# Altium project IIR_Loader.PrjPcb
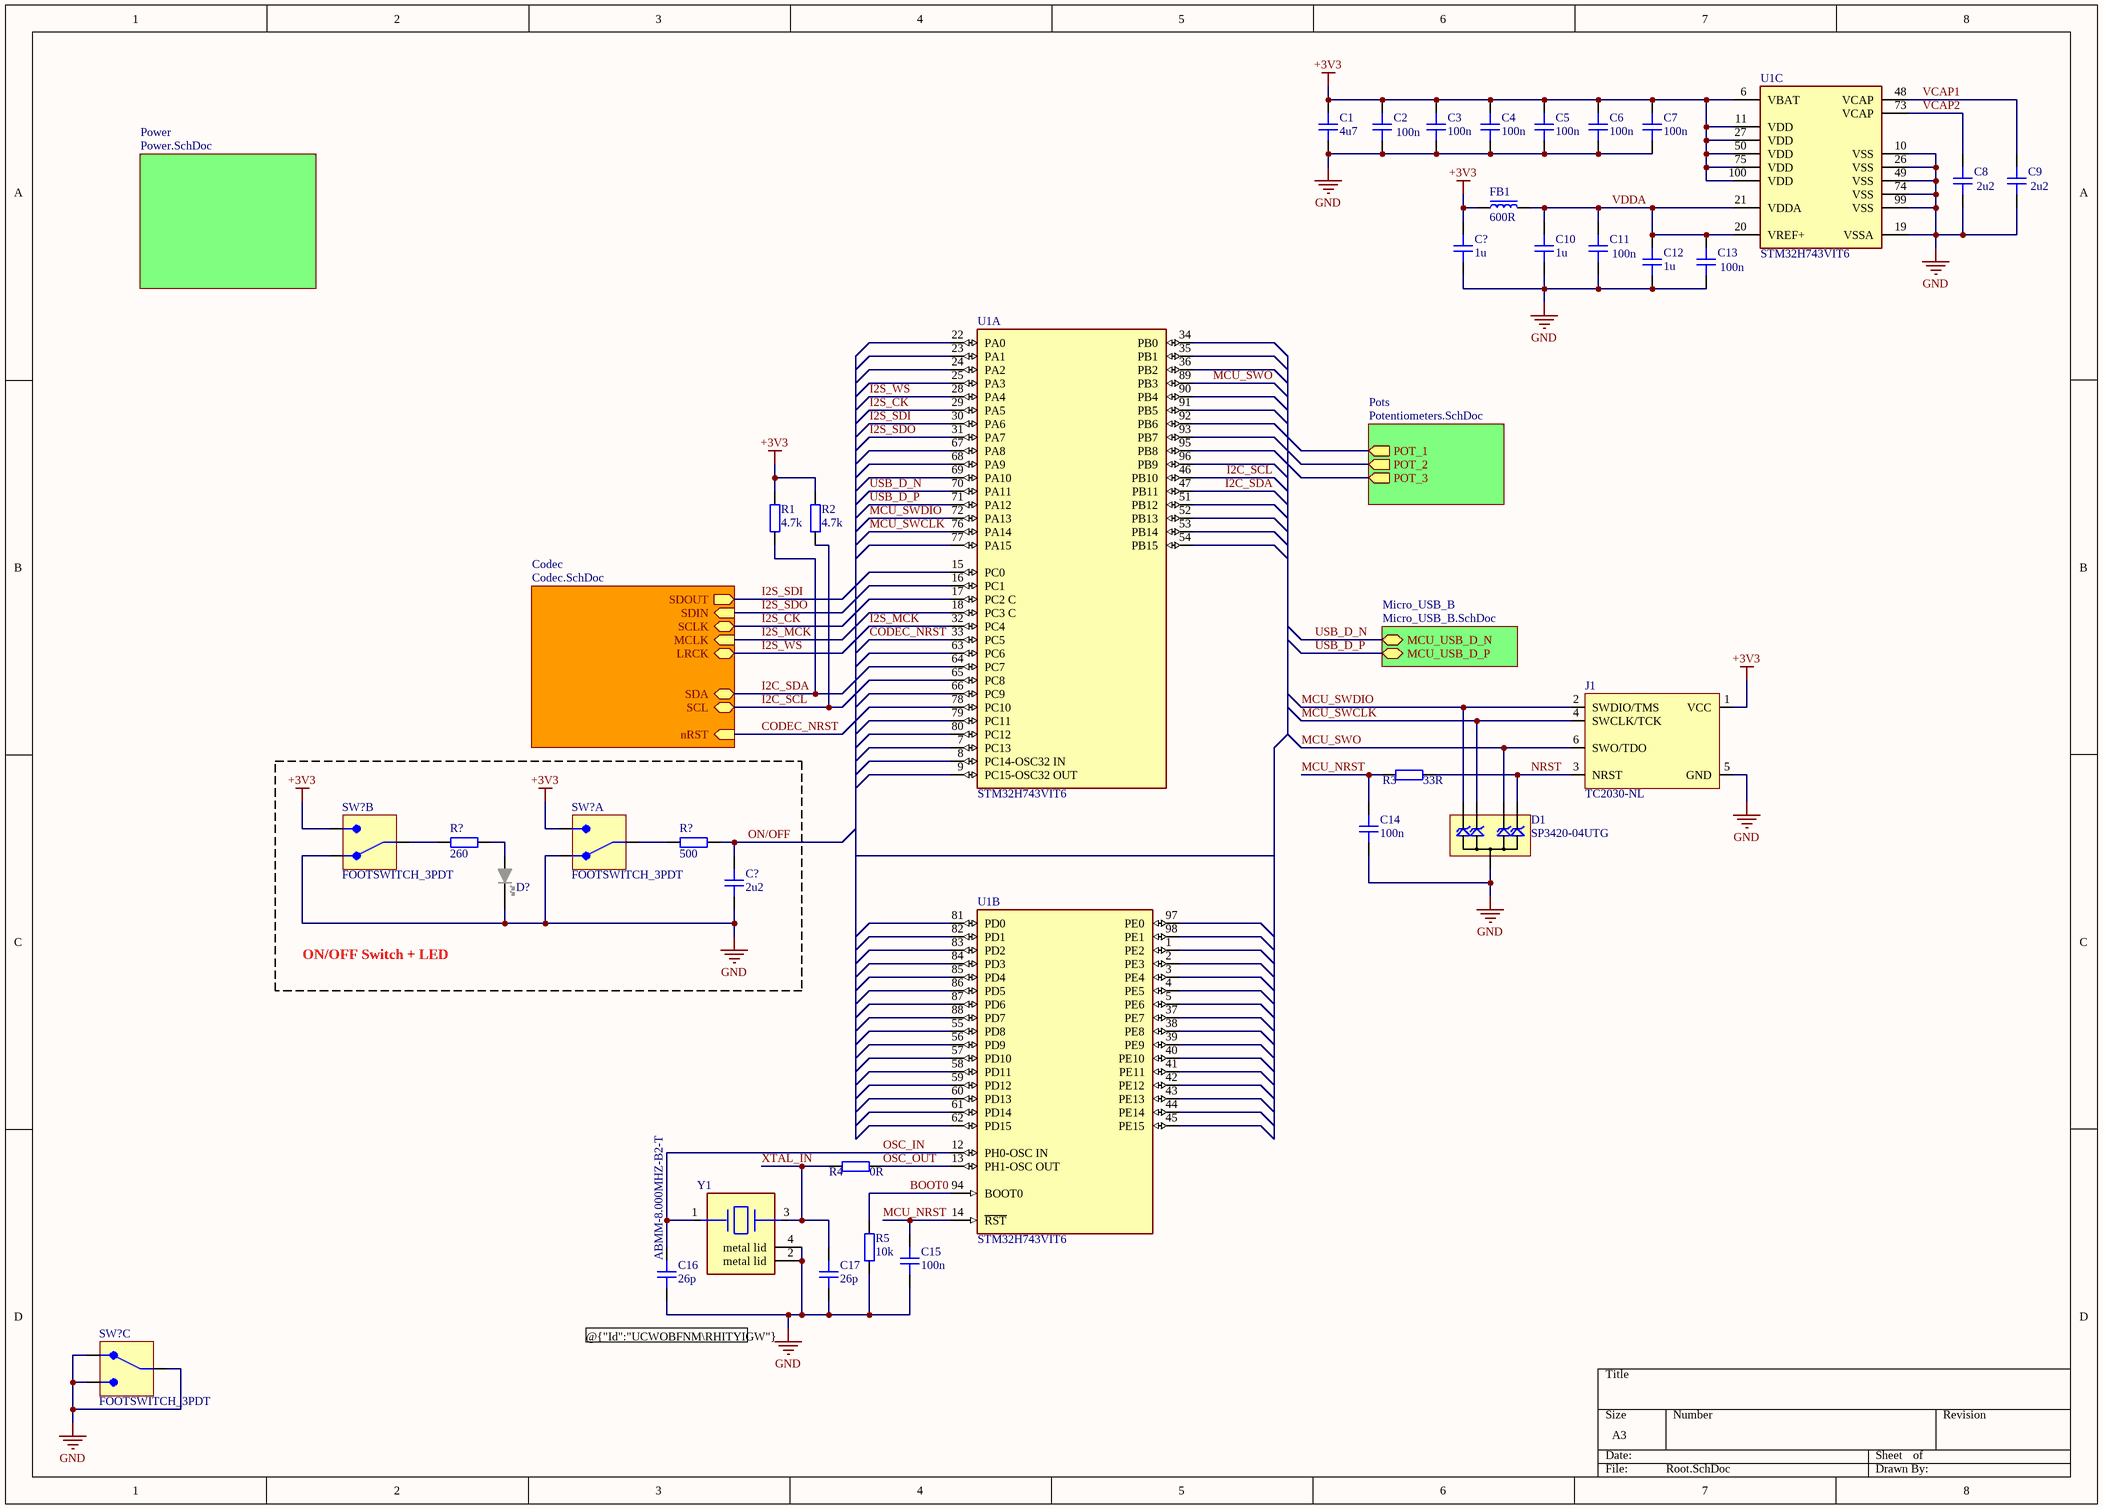
[diagram p0: Root.SchDoc]
6 sheets, 159 parts. Net scope: hierarchical (ports join the sheet entries above them; power ports are global).
Sheets:
  Root.SchDoc
    Micro_USB_B = Micro_USB_B.SchDoc
    Codec = Codec.SchDoc
      FILT3 = RC_Filter.SchDoc
      FILT4 = RC_Filter.SchDoc
      FILT1 = RC_Filter.SchDoc
      FILT2 = RC_Filter.SchDoc
    Power = Power.SchDoc
    Pots = Potentiometers.SchDoc

## Sheet Root.SchDoc
size A3; SheetNumber: 1; SheetTotal: 6

### Parts
(Parts that share a designator on the sheet are numbered #1, #2 ... from top to bottom, then left to right.)
C1  4u7  [CAP_0603]
C2  100n  [CAP_0402]
C3  100n  [CAP_0402]
C4  100n  [CAP_0402]
C5  100n  [CAP_0402]
C6  100n  [CAP_0402]
C7  100n  [CAP_0402]
C8  2u2  [CAP_0402]
C9  2u2  [CAP_0402]
C10  1u  [CAP_0603]
C11  100n  [CAP_0402]
C12  1u  [CAP_0603]
C13  100n  [CAP_0402]
C14  100n  [CAP_0402]
C15  100n  [CAP_0402]
C16  26p  [CAP_0402]
C17  26p  [CAP_0402]
C?#1  1u  [CAP_0603]
C?#2  2u2  [CAP_0603]
D1  SP3420-04UTG  [uDFN-10]
D?#1  LED  [SLM-490]  (value not drawn)
FB1  600R  [FB_0805]
J1  TC2030-NL  [TC2030-NL-FP]  (no BOM)
R1  4.7k  [RES_0402]
R2  4.7k  [RES_0402]
R3  33R  [RES_0402]
R4  0R  [RES_0402]
R5  10k  [RES_0402]
R?#1  260  [RES_0603]
R?#2  500  [RES_0603]
SW?#1  FOOTSWITCH_3PDT  [FOOTSWITCH_3PDT]  (part B of 3)
SW?#2  FOOTSWITCH_3PDT  [FOOTSWITCH_3PDT]  (part A of 3)
SW?#3  FOOTSWITCH_3PDT  [FOOTSWITCH_3PDT]  (part C of 3)
U1  STM32H743VIT6  [FP-LQFP100-1L-MFG]  (parts A,B,C of 3)
Y1  ABMM-8.000MHZ-B2-T  [FP-ABMM-MFG]

### Blocks framed on the sheet
ON/OFF Switch + LED: C?#2 D?#1 R?#1 R?#2 SW?#1 SW?#2

### Sub-sheets
Codec = Codec.SchDoc: SDIN (in), SDOUT (out), LRCK (bidir), SCLK (bidir), MCLK (in), SDA (bidir), SCL (bidir), nRST (in)
Micro_USB_B = Micro_USB_B.SchDoc: MCU_USB_D_N (bidir), MCU_USB_D_P (bidir)
Pots = Potentiometers.SchDoc: POT_1 (out), POT_2 (out), POT_3 (out)
Power = Power.SchDoc: no entries

### Nets
+3V3: C1.2 C2.2 C3.2 C4.2 C5.2 C6.2 C7.2 C?#1.2 FB1.1 J1.1(VCC) R1.2 R2.2 SW?#1.NO2 SW?#2.NO1 U1.6(VBAT) U1.11(VDD) U1.27(VDD) U1.50(VDD) U1.75(VDD) U1.100(VDD)
GND: C1.1 C2.1 C3.1 C4.1 C5.1 C6.1 C7.1 C8.1 C9.1 C10.1 C11.1 C12.1 C13.1 C14.1 C15.1 C16.1 C17.1 C?#1.1 C?#2.1 D1.38(GND) D?#1.K J1.5(GND) R5.1 SW?#1.NC2 SW?#2.NC1 SW?#3.COM3 SW?#3.NC3 SW?#3.NO3 U1.10(VSS) U1.19(VSSA) U1.26(VSS) U1.49(VSS) U1.74(VSS) U1.99(VSS) Y1.2(metal_lid) Y1.4(metal_lid)
BOOT0: R5.2 U1.94(BOOT0)
CODEC_NRST: U1.33(PC5) ; sheet Codec/nRST
I2C_SCL: R2.1 U1.46(PB10) ; sheet Codec/SCL
I2C_SDA: R1.1 U1.47(PB11) ; sheet Codec/SDA
I2S_CK: U1.29(PA5) ; sheet Codec/SCLK
I2S_MCK: U1.32(PC4) ; sheet Codec/MCLK
I2S_SDI: U1.30(PA6) ; sheet Codec/SDOUT
I2S_SDO: U1.31(PA7) ; sheet Codec/SDIN
I2S_WS: U1.28(PA4) ; sheet Codec/LRCK
MCU_NRST: C14.2 C15.2 R3.1 U1.14(~{RST})
MCU_SWCLK: D1.29 J1.4(SWCLK/TCK) U1.76(PA14)
MCU_SWDIO: D1.110 J1.2(SWDIO/TMS) U1.72(PA13)
MCU_SWO: D1.47 J1.6(SWO/TDO) U1.89(PB3)
NRST: D1.56 J1.3(NRST) R3.2
ON/OFF: C?#2.2 R?#2.1
OSC_IN: C16.2 U1.12(PH0-OSC_IN) Y1.1
OSC_OUT: R4.2 U1.13(PH1-OSC_OUT)
USB_D_N: U1.70(PA11) ; sheet Micro_USB_B/MCU_USB_D_N  [project net MCU_USB_D_N]
USB_D_P: U1.71(PA12) ; sheet Micro_USB_B/MCU_USB_D_P  [project net MCU_USB_D_P]
VCAP1: C9.2 U1.48(VCAP)
VCAP2: C8.2 U1.73(VCAP)
VDDA: C10.2 C11.2 C12.2 C13.2 FB1.2 U1.20(VREF+) U1.21(VDDA)
XTAL_IN: C17.2 R4.1 Y1.3
NetD?#1_A: D?#1.A R?#1.1
NetR?#1_2: R?#1.2 SW?#1.COM2
NetR?#2_2: R?#2.2 SW?#2.COM1

Not connected (* = marked no-connect by the designer): U1 1(PE2) 2(PE3) 3(PE4) 4(PE5) 5(PE6) 7(PC13) 8(PC14-OSC32_IN) 9(PC15-OSC32_OUT) 15(PC0) 16(PC1) 17(PC2_C) 18(PC3_C) 22(PA0) 23(PA1) 24(PA2) 25(PA3) 34(PB0) 35(PB1) 36(PB2) 37(PE7) 38(PE8) 39(PE9) 40(PE10) 41(PE11) 42(PE12) 43(PE13) 44(PE14) 45(PE15) 51(PB12) 52(PB13) 53(PB14) 54(PB15) 55(PD8) 56(PD9) 57(PD10) 58(PD11) 59(PD12) 60(PD13) 61(PD14) 62(PD15) 63(PC6) 64(PC7) 65(PC8) 66(PC9) 67(PA8) 68(PA9) 69(PA10) 77(PA15) 78(PC10) 79(PC11) 80(PC12) 81(PD0) 82(PD1) 83(PD2) 84(PD3) 85(PD4) 86(PD5) 87(PD6) 88(PD7) 90(PB4) 91(PB5) 92(PB6) 93(PB7) 95(PB8) 96(PB9) 97(PE0) 98(PE1)

### Notes on the sheet
- (near C16) @{"Id":"UCWOBFNM\RHITYIGW"} & @{"Id":"UCWOBFNM\OAWXIDPK"} Class I Capacitors

### Library data of the parts
C1 C10 C12 C?#1 = CAP_0603: 16V; Manufacturer: *; Manufacturer Part Number: *; Distributor Link: *; LCSC: *; Rating: *; Dielectric: *
C2-C9 C11 C13-C15 = CAP_0402: 16V; Manufacturer: *; Manufacturer Part Number: *; Distributor Link: *; LCSC: *; Rating: *; Dielectric: *
C16 C17 = CAP_0402: Capacitor SMD 0402; Manufacturer: *; Manufacturer Part Number: *; Distributor Link: *; LCSC: *; Rating: *; Dielectric: *
C?#2 = CAP_0603: Capacitor SMD 0603; Manufacturer: *; Manufacturer Part Number: *; Distributor Link: *; LCSC: *; Rating: *; Dielectric: *
D1 = SP3420-04UTG: TVS Diode Array Low Capacitance ESD Protection 4-Channel (Vwork=3V3, Vclamp=6V); Manufacturer: Littelfuse; Manufacturer Part Number: SP3420-04UTG
D?#1 = LED_5MM_HOLDER_16MM1: 5mm LED Holder Height 16.1mm (w/o LED); Manufacturer: BIVAR; Manufacturer Part Number: SLM-490
FB1 = FB_0805: 300mOhm DC, 600R @ 100MHz; Manufacturer: *; Manufacturer Part Number: *; Distributor Link: *; LCSC: *
J1 = TC2030-NL: Tag-Connect No-Solder SWD Debug Connector (No Legs) DO NOT PLACE; Manufacturer: Tag-Connect; Manufacturer Part Number: TC2030-NL-FP
R1-R5 = RES_0402: Resistor SMD 0402; Manufacturer: *; Manufacturer Part Number: *; Distributor Link: *; LCSC: *
R?#1 R?#2 = RES_0603: Resistor SMD 0603; Manufacturer: *; Manufacturer Part Number: *; Distributor Link: *; LCSC: *
SW?#1-SW?#3 = FOOTSWITCH_3PDT: Generic 3PDT Footswitch; Manufacturer: *; Manufacturer Part Number: *; Link: https://lovemyswitches.com/3pdt-latched-foot-switch-solder-lugs-black/
U1 = CMP-12105-000050-1: IC MCU 32BIT 2MB FLASH 100LQFP; Manufacturer: STMicroelectronics; Number Of Ethernet Channels: 1; Number Of Usb Channels: 2; Number Of A/D Converters: 3; Min Supply Voltage: 1.71V; Ram Size: 1060KBytes; Number Of I2C Channels: 4; Frequency: 480MHz; Number Of Adc Channels: 36; Number Of I/Os: 82; Max Supply Voltage: 3.6V; Number Of Spi Channels: 6; Memory Size: 2MBytes; Max Junction Temp: +125°C; Core Architecture: Arm Cortex-M7; Interface: I2C,SPI,UART,USART,USB,LIN,IrDA,Ethernet,I2S,Other; Number Of Timers/Counters: 20; Data Bus Width: 32bits; Number Of Pwm Channels: 42; Number Of Uart Channels: 9; Standoff Height: 0.05mm; Device Class L1: Integrated Circuits (ICs); ComponentLink2URL: https://www.st.com/resource/en/datasheet/stm32h743vi.pdf; Automotive: No; Memory Type: FLASH; Number Of Cores: 1; Temperature Range Low: -40°C; RoHS: TRUE; Ambient Temperature Range Low: -40°C; ComponentLink2Description: Datasheet; Device Class L2: Embedded Processors and Controllers; Device Class L3: Microcontrollers; Digikey Description: IC MCU 32BIT 2MB FLASH 100LQFP; Temperature Range High: +125°C; Ambient Temperature Range High: +85°C; Package: LQFP100-1L; Temperature: -40°C to +125°C; Category: IC; Ipc Land Pattern Name: QFP50P1600X1600X160-100; Height: 1.6mm; Manufacturer Part Number: STM32H743VIT6; Octopart: https://octopart.com/stm32h743vit6-stmicroelectronics-76372527; Lead Free: Yes
Y1 = CMP-27762-006043-1: CRYSTAL 8.0000MHZ 18PF SMD; Tolerance: 20ppm; Frequency: 8MHz; Frequency Stability: 50ppm; Operating Frequency: 8 MHz; ESR (Equivalent Series Resistance): 70R; Package Quantity: 1000; Number of Pins: 4; Mount: Surface Mount; Accuracy: 20ppm; Depth: 5.2mm; Resistor Type: Ceramic; Lead Free: Lead Free; Series: ABMM; Packaging: Tape and Reel; Length: 7.2mm; REACH SVHC: No SVHC; Termination: SMD/SMT; Load Capacitance: 18pF; Case/Package: CSMD; Width: 0.197inch; Max Operating Temperature: 70°C; Radiation Hardening: No; Series Resistance: 70R; Frequency Tolerance: 20ppm; Min Operating Temperature: -20°C; Height: 0.051inch

## Sheet Micro_USB_B.SchDoc
size A4; SheetNumber: 2; SheetTotal: 6
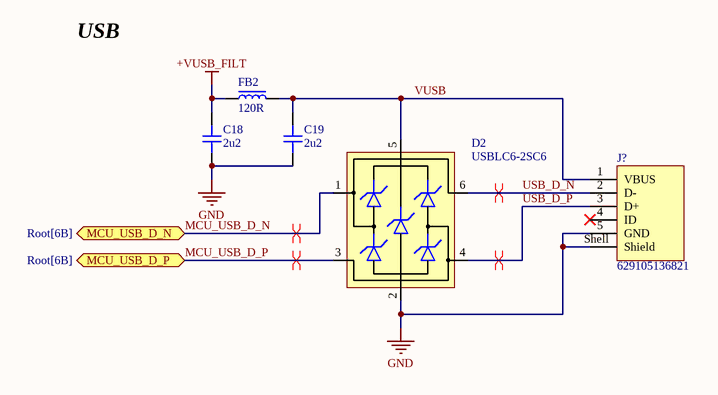
[diagram p1: Micro_USB_B.SchDoc]

### Parts
C18  2u2  [CAP_0603]
C19  2u2  [CAP_0603]
D2  USBLC6-2SC6  [SOT-23-6]
FB2  120R  [FB_0603]
J?  629105136821  [629105136821]

### Ports
MCU_USB_D_N (bidir, see Root[6B]), MCU_USB_D_P (bidir, see Root[6B])

### Nets
+VUSB_FILT: C18.2 FB2.1
GND: C18.1 C19.1 D2.2(GND) J?.5(GND) J?.Shell(Shield)
MCU_USB_D_N: D2.1(IO1) ; port MCU_USB_D_N
MCU_USB_D_P: D2.3(IO2) ; port MCU_USB_D_P
USB_D_N: D2.6(IO1) J?.2(D-)
USB_D_P: D2.4(IO2) J?.3(D+)
VUSB: C19.2 D2.5(VBUS) FB2.2 J?.1(VBUS)

Not connected (* = marked no-connect by the designer): J? 4(ID)*

### Layout directives
differential pair: MCU_USB_D_N, MCU_USB_D_P, USB_D_N, USB_D_P

### Notes on the sheet
- USB

### Library data of the parts
C18 C19 = CAP_0603: 16V; Manufacturer: *; Manufacturer Part Number: *; Distributor Link: *; LCSC: *; Rating: *; Dielectric: *
D2 = USBLC6-2SC6: Low-Capacitance ESD Protection USB; Manufacturer: STMicroelectronics; Manufacturer Part Number: USBLC6-2SC6; Distributor Link: https://www.mouser.de/ProductDetail/STMicroelectronics/USBLC6-2SC6?qs=po45yt2pPpu%2FhNIlwQdTlg%3D%3D
FB2 = FB_0603: 30mOhm; Manufacturer: *; Manufacturer Part Number: *; Distributor Link: *; LCSC: *
J? = CMP-1502-03253-2: NexarPartId: 19991173; Insulation Resistance: 1GΩ; Contact Resistance: 30mΩ; Number of Contacts: 5; Number of Ports: 1; Gender: Receptacle; Current Rating: 1A; Connector Type: USB; Voltage Rating: 30V; USB Standard: USB 2.0; Plating: Nickel; Max Operating Temperature: 105°C; Orientation: Horizontal; Height: 2.9mm; Termination: Solder; Min Operating Temperature: -40°C; Number of Pins: 5; Flammability Rating: UL94 V-0; Lead Free: Lead Free; Packaging: Tape and Reel; Contact Plating: Gold; RoHS: Compliant; Mount: Horizontal, Surface Mount; Color: Black; REACH SVHC: Unknown; Operating Supply Voltage: 30V; Contact Material: Copper; Number of Positions: 5; Length: 5.9mm

## Sheet Codec.SchDoc
size A4; SheetNumber: 3; SheetTotal: 6
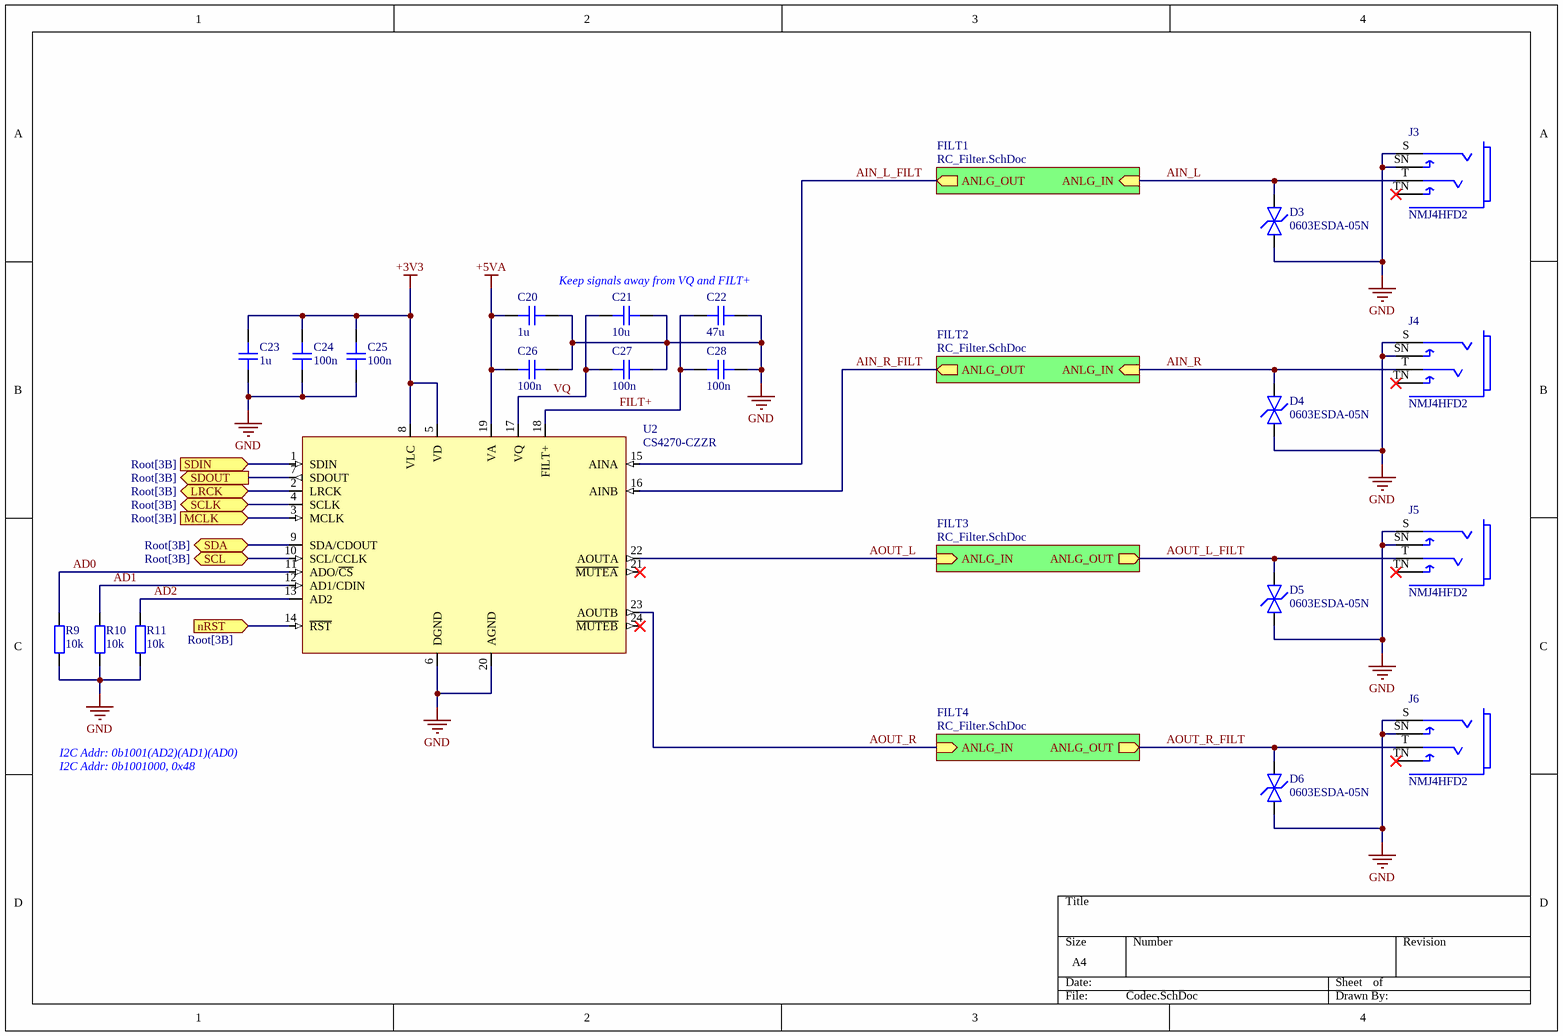
[diagram p2: Codec.SchDoc]

### Parts
C20  1u  [CAP_0603]
C21  10u  [CAP_1210]
C22  47u  [CAP_1210]
C23  1u  [CAP_0603]
C24  100n  [CAP_0603]
C25  100n  [CAP_0603]
C26  100n  [CAP_0603]
C27  100n  [CAP_0603]
C28  100n  [CAP_0603]
D3  0603ESDA-05N  [D_0603]
D4  0603ESDA-05N  [D_0603]
D5  0603ESDA-05N  [D_0603]
D6  0603ESDA-05N  [D_0603]
J3  NMJ4HFD2  [FP-NMJ4HFD2-MFG]
J4  NMJ4HFD2  [FP-NMJ4HFD2-MFG]
J5  NMJ4HFD2  [FP-NMJ4HFD2-MFG]
J6  NMJ4HFD2  [FP-NMJ4HFD2-MFG]
R9  10k  [RES_0603]
R10  10k  [RES_0603]
R11  10k  [RES_0603]
U2  CS4270-CZZR  [TSSOP-24]

### Sub-sheets
FILT1 = RC_Filter.SchDoc: ANLG_IN (in), ANLG_OUT (out)
FILT2 = RC_Filter.SchDoc: ANLG_IN (in), ANLG_OUT (out)
FILT3 = RC_Filter.SchDoc: ANLG_IN (in), ANLG_OUT (out)
FILT4 = RC_Filter.SchDoc: ANLG_IN (in), ANLG_OUT (out)

### Ports
LRCK (bidir, see Root[3B]), MCLK (in, see Root[3B]), nRST (in, see Root[3B]), SCL (bidir, see Root[3B]), SCLK (bidir, see Root[3B]), SDA (bidir, see Root[3B]), SDIN (in, see Root[3B]), SDOUT (out, see Root[3B])

### Nets
+3V3: C23.2 C24.1 C25.1 U2.5(VD) U2.8(VLC)
+5VA: C20.1 C26.2 U2.19(VA)
GND: C20.2 C21.2 C22.2 C23.1 C24.2 C25.2 C26.1 C27.2 C28.2 D3.A D4.A D5.A D6.A J3.S J3.SN J4.S J4.SN J5.S J5.SN J6.S J6.SN R9.1 R10.1 R11.1 U2.6(DGND) U2.20(AGND)
AD0: R9.2 U2.11(ADO/~{CS})
AD1: R10.2 U2.12(AD1/CDIN)
AD2: R11.2 U2.13(AD2)
AIN_L: D3.K J3.T ; sheet FILT1/ANLG_IN
AIN_L_FILT: U2.15(AINA) ; sheet FILT1/ANLG_OUT
AIN_R: D4.K J4.T ; sheet FILT2/ANLG_IN
AIN_R_FILT: U2.16(AINB) ; sheet FILT2/ANLG_OUT
AOUT_L: U2.22(AOUTA) ; sheet FILT3/ANLG_IN
AOUT_L_FILT: D5.K J5.T ; sheet FILT3/ANLG_OUT
AOUT_R: U2.23(AOUTB) ; sheet FILT4/ANLG_IN
AOUT_R_FILT: D6.K J6.T ; sheet FILT4/ANLG_OUT
CODEC_NRST: U2.14(~{RST}) ; port nRST
FILT+: C22.1 C28.1 U2.18(FILT+)
I2C_SCL: U2.10(SCL/CCLK) ; port SCL
I2C_SDA: U2.9(SDA/CDOUT) ; port SDA
I2S_CK: U2.4(SCLK) ; port SCLK
I2S_MCK: U2.3(MCLK) ; port MCLK
I2S_SDI: U2.7(SDOUT) ; port SDOUT
I2S_SDO: U2.1(SDIN) ; port SDIN
I2S_WS: U2.2(LRCK) ; port LRCK
VQ: C21.1 C27.1 U2.17(VQ)

Not connected (* = marked no-connect by the designer): J3 TN*; J4 TN*; J5 TN*; J6 TN*; U2 21(~{MUTEA})* 24(~{MUTEB})*

### Notes on the sheet
- Keep signals away from VQ and FILT+
- I2C Addr: 0b1001(AD2)(AD1)(AD0)
- I2C Addr: 0b1001000, 0x48

### Library data of the parts
C20 C23-C28 = CAP_0603: Capacitor SMD 0603; Manufacturer: *; Manufacturer Part Number: *; Distributor Link: *; LCSC: *; Rating: *; Dielectric: *
C21 C22 = CAP_1210: Capacitor SMD 1210; Manufacturer: *; Manufacturer Part Number: *; Distributor Link: *; LCSC: *; Rating: *; Dielectric: *
D3-D6 = D_TVS_BI_0603: Diode TVS / ESD Bidirectional 0603; Manufacturer: *; Manufacturer Part Number: *
J3-J6 = CMP-78736-000001-1: Conn 1/4" Mono Jack F 3 POS Solder RA Thru-Hole 3 Terminal 1 Port; Manufacturer: Neutrik; Number Of Contacts: 2; Current Rating: 0.5A; Voltage Rating: 50V; Conn Orientation: Horizontal; Is Female: yes; Temperature: -25°C to +70°C; ComponentLink2Description: Datasheet; ComponentLink2URL: https://www.neutrik.com/en/product/nmj4hfd2.pdf; Contact Material: Silver; Height: 15.89mm; Package: 0; Mouser Description: Phone Audio Connector, Socket, 2, PCB Mount, Metal Body, Silver Plated Contacts; Manufacturer Part Number: NMJ4HFD2; Automotive: No; RoHS: TRUE; Lead Free: Yes; Device Class L2: Audio / Video Connectors; Device Class L3: unset; Temperature Range Low: -25°C; Category: Conn; Footprint Url: https://www.neutrik.com/media/8576/download/st-nmj4hfd2.pdf?v=1; Temperature Range High: +70°C; Device Class L1: Connectors; Octopart: https://octopart.com/nmj4hfd2-neutrik-758952
R9-R11 = RES_0603: Resistor SMD 0603; Manufacturer: *; Manufacturer Part Number: *; Distributor Link: *; LCSC: *
U2 = CS4270-CZZR: 24-Bit 192kHz Stereo Audio Codec TSSOP-24; Manufacturer: Cirrus Logic; Manufacturer Part Number: CS4270-CZZR

## Sheet RC_Filter.SchDoc
size A4; SheetNumber: 4; SheetTotal: 6
Used 4 times, as channels Codec/FILT3, Codec/FILT4, Codec/FILT1, Codec/FILT2. Parts and nets are listed once, with the designators drawn on the sheet.
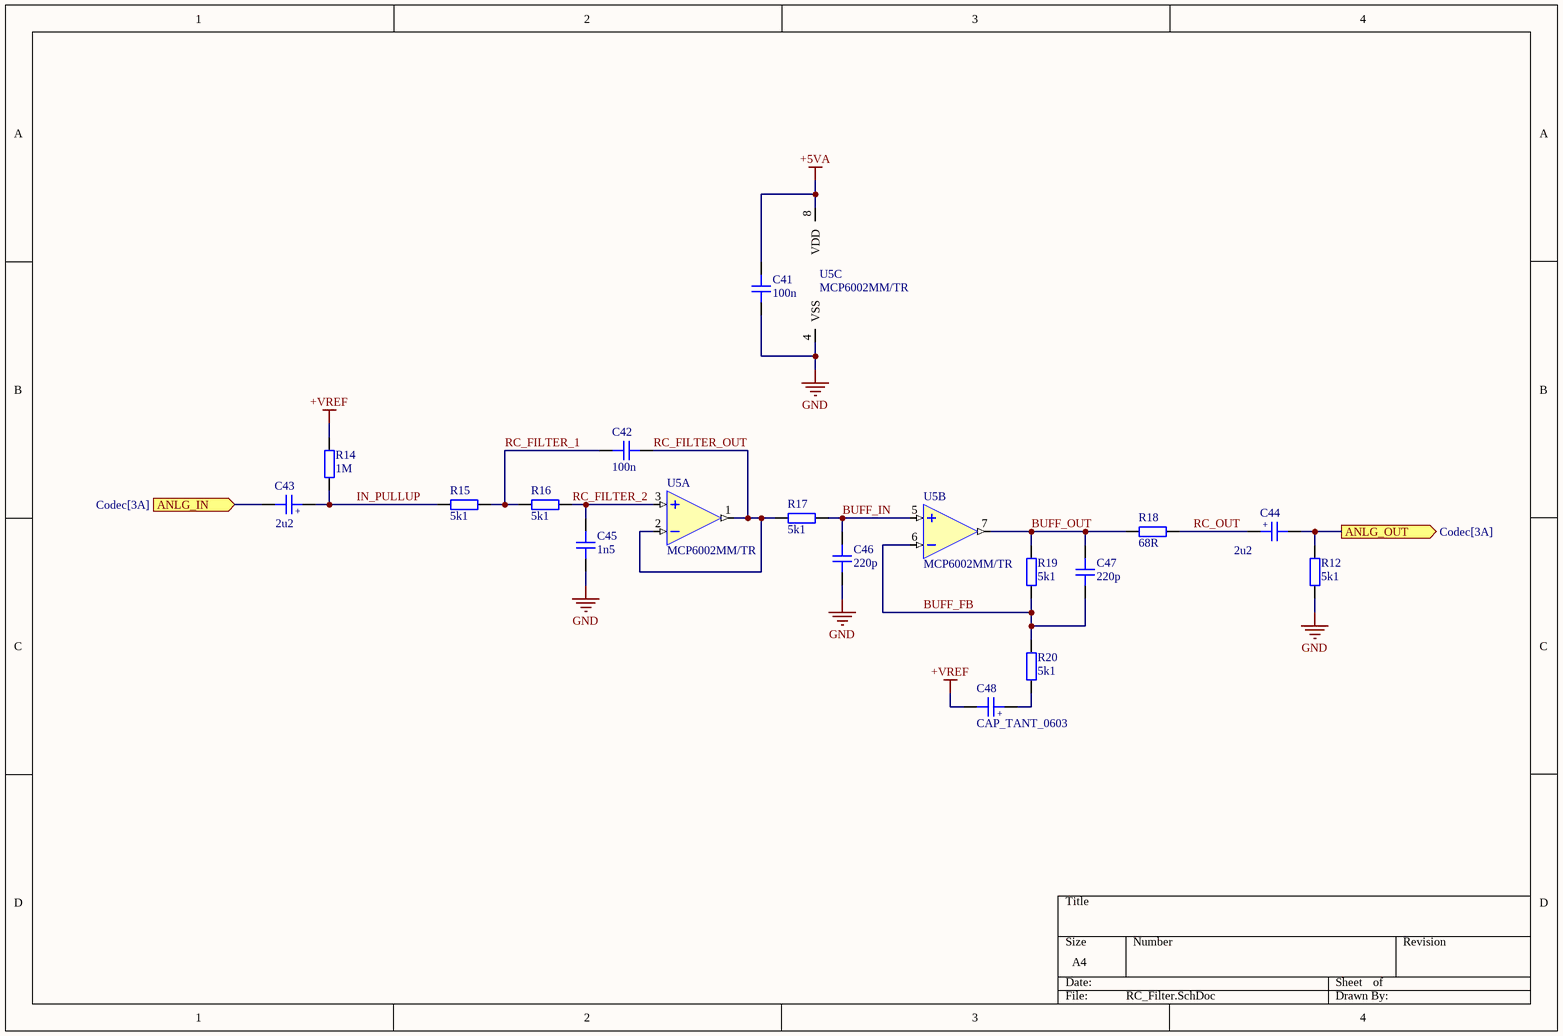
[diagram p3: RC_Filter.SchDoc]

### Parts
C41  100n  [CAP_0603]
C42  100n  [CAP_0603]
C43  2u2  [CAP_TANT_0603]
C44  2u2  [CAP_TANT_0603]
C45  1n5  [CAP_0603]
C46  220p  [CAP_0603]
C47  220p  [CAP_0603]
C48  CAP_TANT_0603  [CAP_TANT_0603]
R12  5k1  [RES_0603]
R14  1M  [RES_0603]
R15  5k1  [RES_0603]
R16  5k1  [RES_0603]
R17  5k1  [RES_0603]
R18  68R  [RES_0603]
R19  5k1  [RES_0603]
R20  5k1  [RES_0603]
U5  MCP6002MM/TR  [MSOP8]  (parts A,B,C of 3)

### Ports
ANLG_IN (in, see Codec[3A]), ANLG_OUT (out, see Codec[3A])

### Nets
+5VA: C41.2 U5.8(VDD)
+VREF: C48.K R14.2
GND: C41.1 C45.2 C46.2 R12.2 U5.4(VSS)
ANLG_IN: C43.K ; port ANLG_IN
ANLG_OUT: C44.K R12.1 ; port ANLG_OUT
BUFF_FB: C47.2 R19.2 R20.1 U5.6(2IN-)
BUFF_IN: C46.1 R17.1 U5.5(2IN+)
BUFF_OUT: C47.1 R18.2 R19.1 U5.7(2OUT)
IN_PULLUP: C43.A R14.1 R15.2
RC_FILTER_1: C42.1 R15.1 R16.2
RC_FILTER_2: C45.1 R16.1 U5.3(1IN+)
RC_FILTER_OUT: C42.2 R17.2 U5.1(1OUT) U5.2(1IN-)
RC_OUT: C44.A R18.1
NetC48_A: C48.A R20.2

### Channels
Codec/FILT3: designators end in A; ports ANLG_IN=AOUT_L ANLG_OUT=AOUT_L_FILT
Codec/FILT4: designators end in B; ports ANLG_IN=AOUT_R ANLG_OUT=AOUT_R_FILT
Codec/FILT1: designators end in C; ports ANLG_IN=AIN_L ANLG_OUT=AIN_L_FILT
Codec/FILT2: designators end in D; ports ANLG_IN=AIN_R ANLG_OUT=AIN_R_FILT

### Notes on the sheet
- (in symbol CAP_TANT_0603) +

### Library data of the parts
C41 C42 C45-C47 = CAP_0603: Capacitor SMD 0603; Manufacturer: *; Manufacturer Part Number: *; Distributor Link: *; LCSC: *; Rating: *; Dielectric: *
C43 C44 C48 = CAP_TANT_0603: Capacitor SMD Tantalum 0603; Manufacturer: *; Manufacturer Part Number: *; Distributor Link: *; LCSC: *
R12 R14-R20 = RES_0603: Resistor SMD 0603; Manufacturer: *; Manufacturer Part Number: *; Distributor Link: *; LCSC: *
U5 = MCP6002MM/TR: 1MHZ CMOS Rail-to-Rail IO Opamp with RF Filter MSOP-8; Manufacturer: HGSEMI; Manufacturer Part Number: MCP6002MM/TR; LCSC: C910874

## Sheet Power.SchDoc
size A4; SheetNumber: 5; SheetTotal: 6
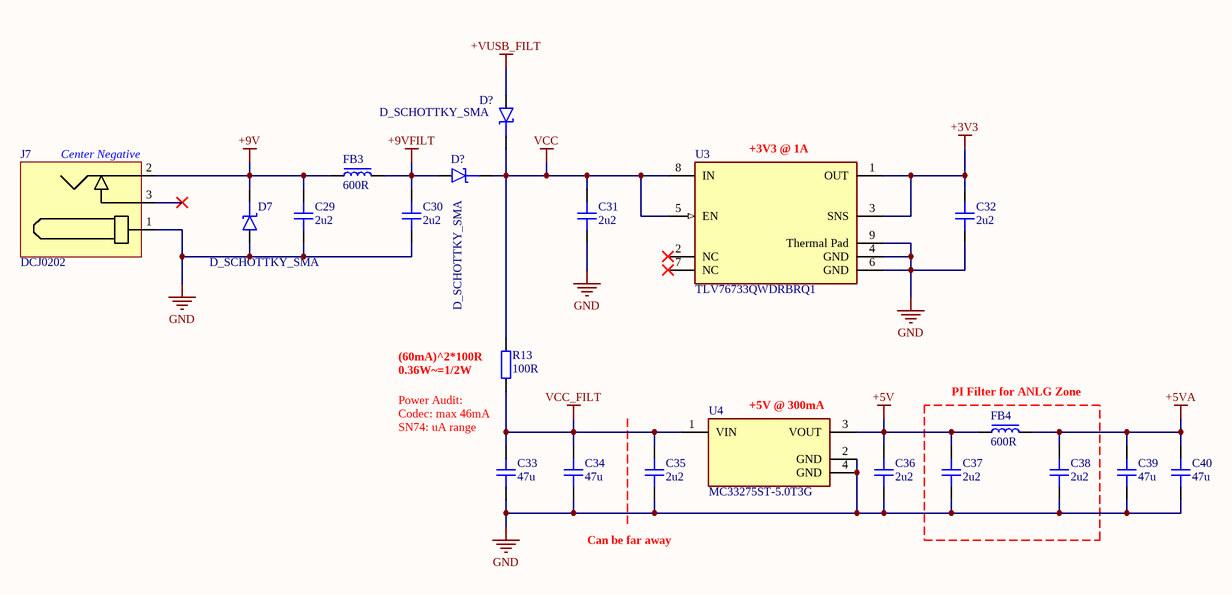
[diagram p4: Power.SchDoc]

### Parts
(Parts that share a designator on the sheet are numbered #1, #2 ... from top to bottom, then left to right.)
C29  2u2  [CAP_0603]
C30  2u2  [CAP_0603]
C31  2u2  [CAP_0603]
C32  2u2  [CAP_0603]
C33  47u  [CAP_0805]
C34  47u  [CAP_0805]
C35  2u2  [CAP_0603]
C36  2u2  [CAP_0603]
C37  2u2  [CAP_0603]
C38  2u2  [CAP_0603]
C39  47u  [CAP_0805]
C40  47u  [CAP_0805]
D7  D_SCHOTTKY_SMA  [DO-214AC-2 (SMA)]
D?#2  D_SCHOTTKY_SMA  [DO-214AC-2 (SMA)]
D?#3  D_SCHOTTKY_SMA  [DO-214AC-2 (SMA)]
FB3  600R  [FB_0603]
FB4  600R  [FB_0603]
J7  DCJ0202  [DCJ0202]
R13  100R  [RES_0805]
U3  TLV76733QWDRBRQ1  [FP-DRB0008J-IPC_C]
U4  MC33275ST-5.0T3G  [FP-318E-04-IPC_A]

### Blocks framed on the sheet
PI Filter for ANLG Zone: C37 C38 FB4

### Nets
+3V3: C32.2 U3.1(OUT) U3.3(SNS)
+5V: C36.2 C37.2 FB4.1 U4.3(VOUT)
+5VA: C38.2 C39.2 C40.2 FB4.2
+9V: C29.2 D7.K FB3.1 J7.2
+9VFILT: C30.2 D?#3.A FB3.2
+VUSB_FILT: D?#2.A
GND: C29.1 C30.1 C31.1 C32.1 C33.1 C34.1 C35.1 C36.1 C37.1 C38.1 C39.1 C40.1 D7.A J7.1 U3.4(GND) U3.6(GND) U3.9(Thermal_Pad) U4.2(GND) U4.4(GND)
VCC: C31.2 D?#2.K D?#3.K R13.2 U3.5(EN) U3.8(IN)
VCC_FILT: C33.2 C34.2 C35.2 R13.1 U4.1(VIN)

Not connected (* = marked no-connect by the designer): J7 3*; U3 2(NC)* 7(NC)*

### Notes on the sheet
- (near U3) +3V3 @ 1A
- (near J7) Center Negative
- (near R13) (60mA)^2*100R
- (near R13) 0.36W~=1/2W
- (near U4) +5V @ 300mA
- Power Audit:
  Codec: max 46mA
  SN74: uA range
- Can be far away

### Library data of the parts
C29-C32 C35-C38 = CAP_0603: Capacitor SMD 0603; Manufacturer: *; Manufacturer Part Number: *; Distributor Link: *; LCSC: *; Rating: *; Dielectric: *
C33 C34 C39 C40 = CAP_0805: Capacitor SMD 0805; Manufacturer: *; Manufacturer Part Number: *; Distributor Link: *; LCSC: *; Rating: *; Dielectric: *
D7 D?#2 D?#3 = D_SCHOTTKY_SMA: Diode Schottky SMD SMA (DO-214AA)
FB3 FB4 = FB_0603: Ferrite Bead SMD 0603; Manufacturer: *; Manufacturer Part Number: *; Distributor Link: *; LCSC: *
J7 = DCJ0202: DC Barrell Jack 2.1mm 24V 5A THT; Manufacturer: CONEC; Manufacturer Part Number: DCJ0202
R13 = RES_0805: Resistor SMD 0805; Manufacturer: *; Manufacturer Part Number: *; Distributor Link: *; LCSC: *
U3 = CMP-04917-000370-1: IC OPAMP; RoHS Compliant: Yes
U4 = CMP-07128-000032-1: IC REG LINEAR 5V 300MA SOT223; Accuracy: 1%; Number of Outputs: 1; Quiescent Current: 2mA; Input Bias Current: 1.5mA; Dropout Voltage: 260mV; Min Input Voltage: 6V; Output Type: Fixed; Max Input Voltage: 13V; Polarity: Positive; Radiation Hardening: No; Mount: Surface Mount; Output Current: 300mA; REACH SVHC: No SVHC; Contact Plating: Tin; Max Output Current: 300mA; Output Voltage: 5V; Number of Pins: 3; Width: 6.7mm; Min Output Voltage: 5V; Height: 1.65mm; Min Operating Temperature: -40°C; Package Quantity: 1; Lead Free: Lead Free; Case/Package: SOT-223; Max Operating Temperature: 125°C; Number of Regulators: 1; Current Rating: 300mA; Nominal Output Voltage: 5V; Output Voltage Accuracy: 1%; Length: 6.7mm; Packaging: Tape and Reel; Halogen Free: Halogen Free

## Sheet Potentiometers.SchDoc
size A4; SheetNumber: 6; SheetTotal: 6
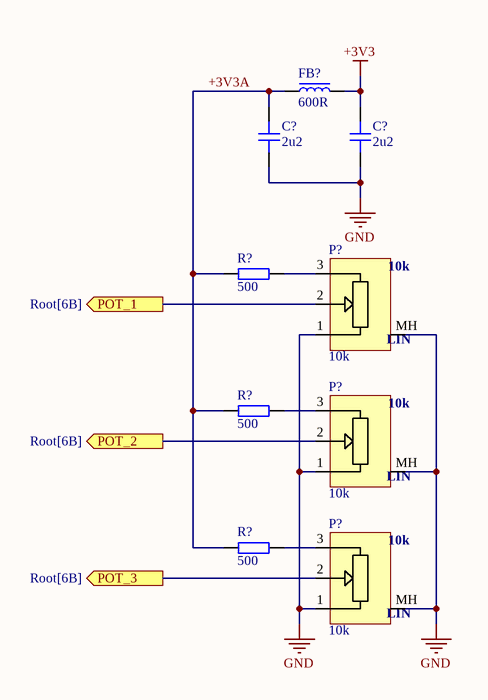
[diagram p5: Potentiometers.SchDoc]

### Parts
(Parts that share a designator on the sheet are numbered #1, #2 ... from top to bottom, then left to right.)
C?#3  2u2  [CAP_0603]
C?#4  2u2  [CAP_0603]
FB?  600R  [FB_0805]
P?#1  10k  [RD901F-40-15R1]
P?#2  10k  [RD901F-40-15R1]
P?#3  10k  [RD901F-40-15R1]
R?#3  500  [RES_0603]
R?#4  500  [RES_0603]
R?#5  500  [RES_0603]

### Ports
POT_1 (out, see Root[6B]), POT_2 (out, see Root[6B]), POT_3 (out, see Root[6B])

### Nets
+3V3: C?#4.2 FB?.2
GND: C?#3.1 C?#4.1 P?#1.1 P?#1.MH P?#2.1 P?#2.MH P?#3.1 P?#3.MH
+3V3A: C?#3.2 FB?.1 R?#3.2 R?#4.2 R?#5.2
NetP?#1_2: P?#1.2 ; port POT_1
NetP?#1_3: P?#1.3 R?#3.1
NetP?#2_2: P?#2.2 ; port POT_2
NetP?#2_3: P?#2.3 R?#4.1
NetP?#3_2: P?#3.2 ; port POT_3
NetP?#3_3: P?#3.3 R?#5.1

### Notes on the sheet
- (in symbol RD901F-40-15R1-B10K) LIN

### Library data of the parts
C?#3 C?#4 = CAP_0603: Capacitor SMD 0603; Manufacturer: *; Manufacturer Part Number: *; Distributor Link: *; LCSC: *; Rating: *; Dielectric: *
FB? = FB_0805: 300mOhm DC, 600R @ 100MHz; Manufacturer: *; Manufacturer Part Number: *; Distributor Link: *; LCSC: *
P?#1-P?#3 = RD901F-40-15R1-B10K: Potentiometer Vertical 10k 20% Linear Taper THT PCB-Mount 6/15mm Shaft Smooth; Manufacturer: Alps Alpine; Manufacturer Part Number: RD901F-40-15R1-B10K; Distributor Link: https://www.mouser.de/ProductDetail/Alpha-Taiwan/RD901F-40-15R1-B10K-00DL1?qs=1mbolxNpo8c1WX5KjxIjjw%3D%3D
R?#3-R?#5 = RES_0603: Resistor SMD 0603; Manufacturer: *; Manufacturer Part Number: *; Distributor Link: *; LCSC: *

## Nets that join several sheets
+3V3: Root (20 pins), Codec (5 pins), Power (C32.2 U3.1 U3.3), Potentiometers (C?#4.2 FB?.2)
+5VA: Codec (C20.1 C26.2 U2.19), Codec/FILT3 (C41A.2 U5A.8), Codec/FILT4 (C41B.2 U5B.8), Codec/FILT1 (C41C.2 U5C.8), Codec/FILT2 (C41D.2 U5D.8), Power (C38.2 C39.2 C40.2 FB4.2)
+VREF: Codec/FILT3 (C48A.K R14A.2), Codec/FILT4 (C48B.K R14B.2), Codec/FILT1 (C48C.K R14C.2), Codec/FILT2 (C48D.K R14D.2)
+VUSB_FILT: Micro_USB_B (C18.2 FB2.1), Power (D?#2.A)
GND: Root (36 pins), Micro_USB_B (5 pins), Codec (26 pins), Codec/FILT3 (5 pins), Codec/FILT4 (5 pins), Codec/FILT1 (5 pins), Codec/FILT2 (5 pins), Power (19 pins), Potentiometers (8 pins)
AIN_L: Codec (D3.K J3.T), Codec/FILT1 (C43C.K)
AIN_L_FILT: Codec (U2.15), Codec/FILT1 (C44C.K R12C.1)
AIN_R: Codec (D4.K J4.T), Codec/FILT2 (C43D.K)
AIN_R_FILT: Codec (U2.16), Codec/FILT2 (C44D.K R12D.1)
AOUT_L: Codec (U2.22), Codec/FILT3 (C43A.K)
AOUT_L_FILT: Codec (D5.K J5.T), Codec/FILT3 (C44A.K R12A.1)
AOUT_R: Codec (U2.23), Codec/FILT4 (C43B.K)
AOUT_R_FILT: Codec (D6.K J6.T), Codec/FILT4 (C44B.K R12B.1)
CODEC_NRST: Root (U1.33), Codec (U2.14)
I2C_SCL: Root (R2.1 U1.46), Codec (U2.10)
I2C_SDA: Root (R1.1 U1.47), Codec (U2.9)
I2S_CK: Root (U1.29), Codec (U2.4)
I2S_MCK: Root (U1.32), Codec (U2.3)
I2S_SDI: Root (U1.30), Codec (U2.7)
I2S_SDO: Root (U1.31), Codec (U2.1)
I2S_WS: Root (U1.28), Codec (U2.2)
MCU_USB_D_N: Root (U1.70), Micro_USB_B (D2.1)
MCU_USB_D_P: Root (U1.71), Micro_USB_B (D2.3)